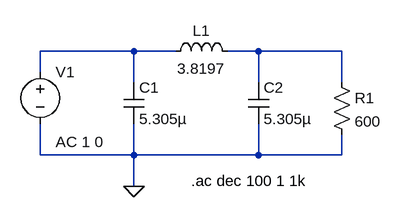
[diagram p0: schematic Draft1.asc]
Draft1.asc, the LTspice schematic file:
Version 4
SHEET 1 880 680
WIRE 64 160 -80 160
WIRE 128 160 64 160
WIRE 256 160 208 160
WIRE 384 160 256 160
WIRE -80 192 -80 160
WIRE 64 208 64 160
WIRE 256 208 256 160
WIRE 384 208 384 160
WIRE -80 320 -80 272
WIRE 64 320 64 272
WIRE 64 320 -80 320
WIRE 256 320 256 272
WIRE 256 320 64 320
WIRE 384 320 384 288
WIRE 384 320 256 320
WIRE 64 368 64 320
FLAG 64 368 0
SYMBOL ind 112 176 R270
WINDOW 0 32 56 VTop 2
WINDOW 3 5 56 VBottom 2
SYMATTR InstName L1
SYMATTR Value 3.8197
SYMBOL cap 48 208 R0
SYMATTR InstName C1
SYMATTR Value 5.305µ
SYMBOL cap 240 208 R0
SYMATTR InstName C2
SYMATTR Value 5.305µ
SYMBOL voltage -80 176 R0
WINDOW 123 24 124 Left 2
WINDOW 39 0 0 Left 0
SYMATTR InstName V1
SYMATTR Value ""
SYMATTR Value2 AC 1 0
SYMBOL res 368 192 R0
SYMATTR InstName R1
SYMATTR Value 600
TEXT 152 360 Left 2 !.ac dec 100 1 1k

The netlist it stands for:
* Draft1.asc
L1 N001 N002 3.8197
C1 N001 0 5.305µ
C2 N002 0 5.305µ
V1 N001 0 AC 1 0
R1 N002 0 600
.ac dec 100 1 1k
.backanno
.end

* Results of the author's LTspice run, read from the files saved beside the schematic
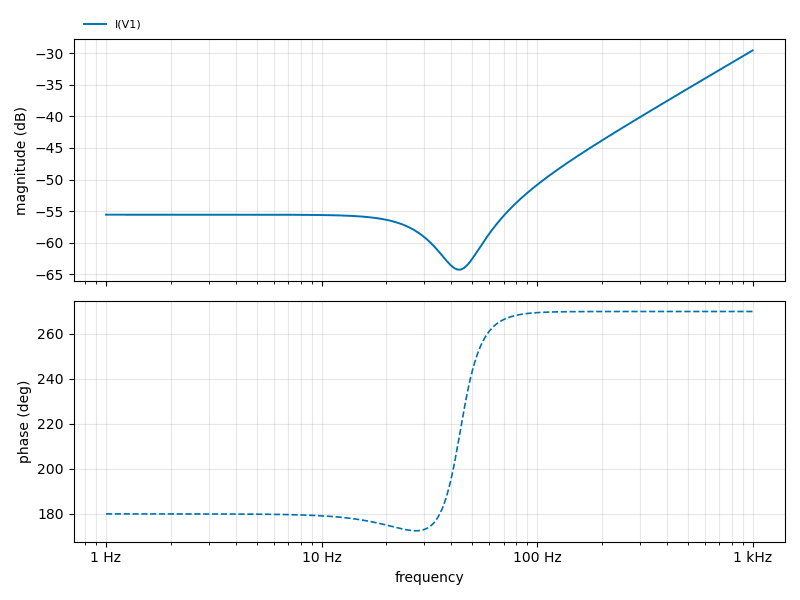
[diagram p1: AC Analysis of Draft1.asc, plotted from the saved traces]
* AC Analysis, 1 run:
*   I(V1): -55.56 dB at 1 Hz, -29.55 dB at 1 kHz, peak -29.55 dB at 1 kHz, 3 dB below the peak at 708 Hz